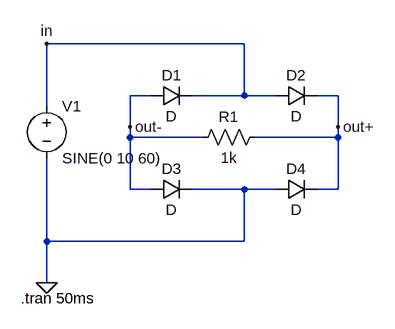
[diagram p0: schematic Assignment 3.2 Scemetic 2.asc]
Assignment 3.2 Scemetic 2.asc, the LTspice schematic file:
Version 4.1
SHEET 1 880 680
WIRE 208 16 -96 16
WIRE 64 96 32 96
WIRE 208 96 208 16
WIRE 208 96 128 96
WIRE 256 96 208 96
WIRE 352 96 320 96
WIRE -96 112 -96 16
WIRE 32 144 32 96
WIRE 352 144 352 96
WIRE 32 160 32 144
WIRE 144 160 32 160
WIRE 352 160 352 144
WIRE 352 160 224 160
WIRE 32 240 32 160
WIRE 64 240 32 240
WIRE 208 240 128 240
WIRE 256 240 208 240
WIRE 352 240 352 160
WIRE 352 240 320 240
WIRE -96 320 -96 192
WIRE 208 320 208 240
WIRE 208 320 -96 320
WIRE -96 384 -96 320
FLAG -96 384 0
FLAG 352 144 out+
FLAG 32 144 out-
FLAG -96 16 in
SYMBOL diode 64 112 R270
WINDOW 0 32 32 VTop 2
WINDOW 3 0 32 VBottom 2
SYMATTR InstName D1
SYMBOL diode 256 112 R270
WINDOW 0 32 32 VTop 2
WINDOW 3 0 32 VBottom 2
SYMATTR InstName D2
SYMBOL diode 64 256 R270
WINDOW 0 32 32 VTop 2
WINDOW 3 0 32 VBottom 2
SYMATTR InstName D3
SYMBOL diode 256 256 R270
WINDOW 0 32 32 VTop 2
WINDOW 3 0 32 VBottom 2
SYMATTR InstName D4
SYMBOL voltage -96 96 R0
WINDOW 123 0 0 Left 0
WINDOW 39 0 0 Left 0
SYMATTR InstName V1
SYMATTR Value SINE(0 10 60)
SYMBOL res 240 144 R90
WINDOW 0 0 56 VBottom 2
WINDOW 3 32 56 VTop 2
SYMATTR InstName R1
SYMATTR Value 1k
TEXT -136 408 Left 2 !.tran 50ms

The netlist it stands for:
* Assignment 3.2 Scemetic 2.asc
D1 out- in D
D2 in out+ D
D3 out- 0 D
D4 0 out+ D
V1 in 0 SINE(0 10 60)
R1 out+ out- 1k
.model D D
.lib standard.dio
.tran 50ms
.backanno
.end